# Altium schematic sheet ESP32.SchDoc
size A2; SheetNumber: 2; SheetTotal: 4
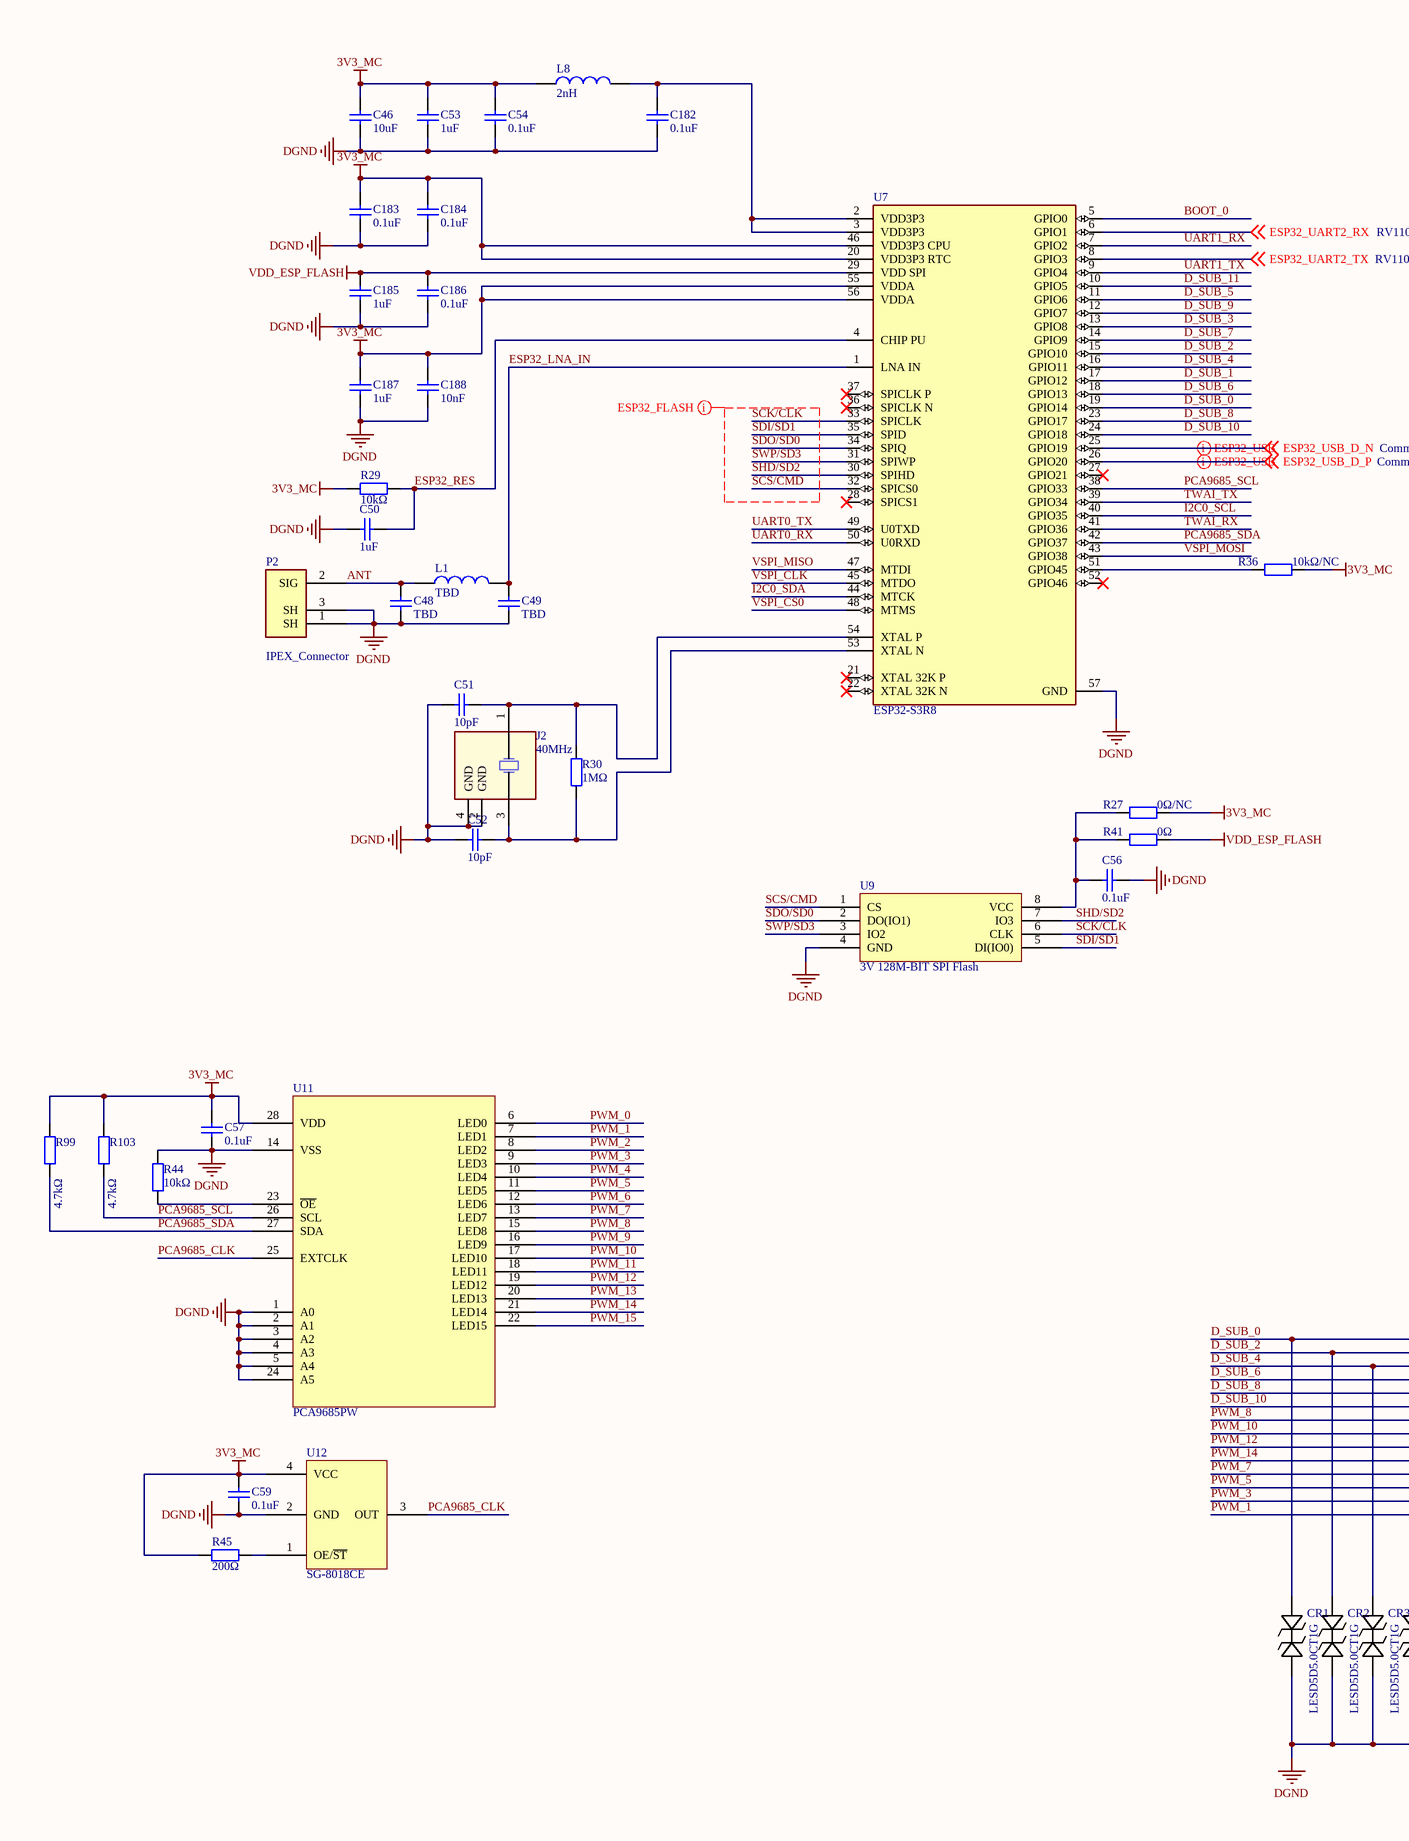
[diagram p0: ESP32.SchDoc, left]
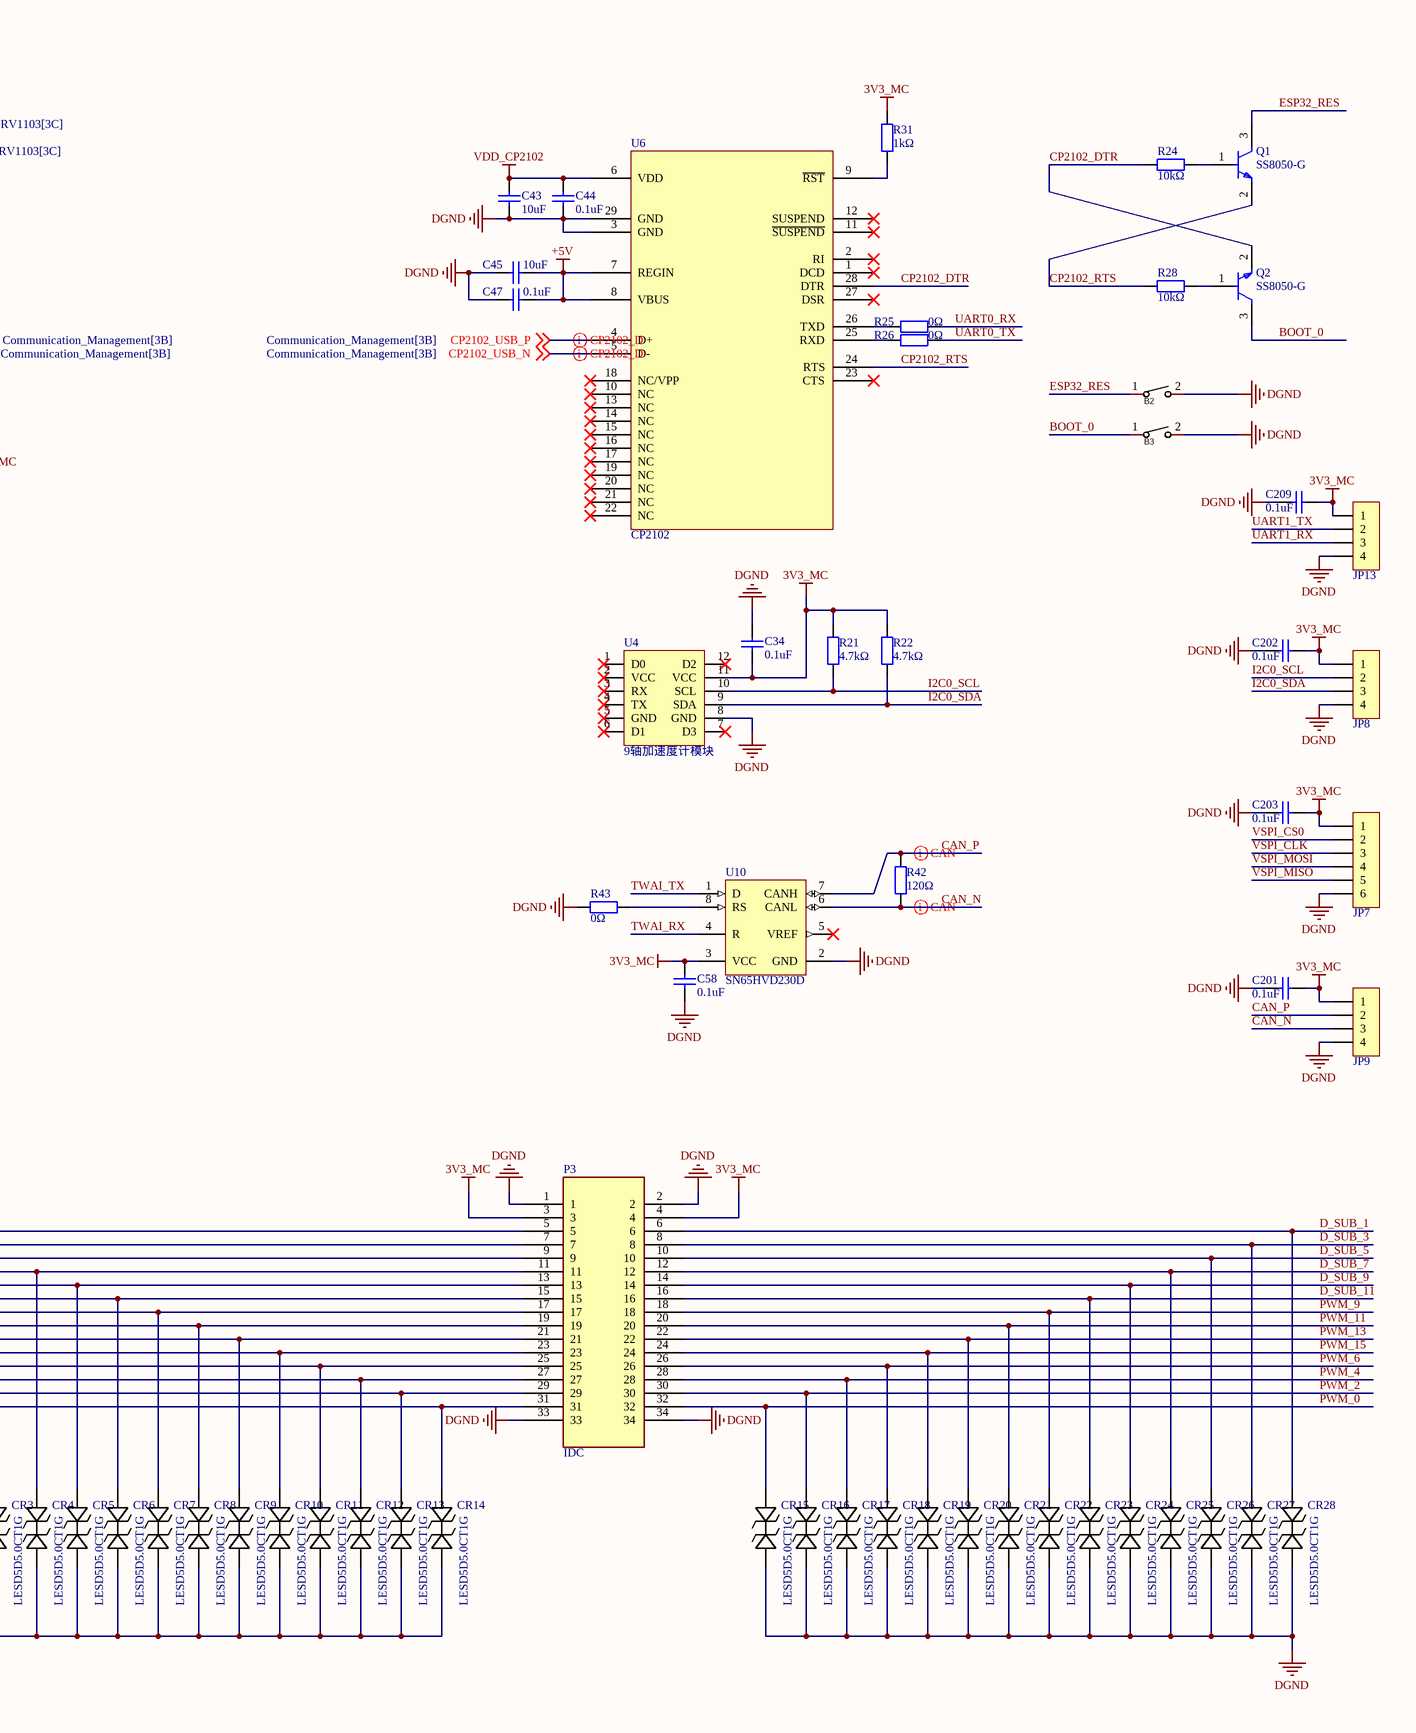
[diagram p1: ESP32.SchDoc, right]

## Parts
B2  Bottom-2P-1Way  [SW-SMD_L4.0-W2.9-LS5.0]  (value not drawn)
B3  Bottom-2P-1Way  [SW-SMD_L4.0-W2.9-LS5.0]  (value not drawn)
C34  0.1uF  [0603_C]
C43  10uF  [0603_C]
C44  0.1uF  [0603_C]
C45  10uF  [0603_C]
C46  10uF  [0603_C]
C47  0.1uF  [0603_C]
C48  TBD  [0402_C]
C49  TBD  [0402_C]
C50  1uF  [0402_C]
C51  10pF  [0402_C]
C52  10pF  [0402_C]
C53  1uF  [0603_C]
C54  0.1uF  [0402_C]
C56  0.1uF  [0603_C]
C57  0.1uF  [0603_C]
C58  0.1uF  [0603_C]
C59  0.1uF  [0603_C]
C182  0.1uF  [0402_C]
C183  0.1uF  [0402_C]
C184  0.1uF  [0402_C]
C185  1uF  [0402_C]
C186  0.1uF  [0402_C]
C187  1uF  [0402_C]
C188  10nF  [0402_C]
C201  0.1uF  [0603_C]
C202  0.1uF  [0603_C]
C203  0.1uF  [0603_C]
C209  0.1uF  [0603_C]
CR1  LESD5D5.0CT1G  [CR_5.0CT1G_UMW]
CR2  LESD5D5.0CT1G  [CR_5.0CT1G_UMW]
CR3  LESD5D5.0CT1G  [CR_5.0CT1G_UMW]
CR4  LESD5D5.0CT1G  [CR_5.0CT1G_UMW]
CR5  LESD5D5.0CT1G  [CR_5.0CT1G_UMW]
CR6  LESD5D5.0CT1G  [CR_5.0CT1G_UMW]
CR7  LESD5D5.0CT1G  [CR_5.0CT1G_UMW]
CR8  LESD5D5.0CT1G  [CR_5.0CT1G_UMW]
CR9  LESD5D5.0CT1G  [CR_5.0CT1G_UMW]
CR10  LESD5D5.0CT1G  [CR_5.0CT1G_UMW]
CR11  LESD5D5.0CT1G  [CR_5.0CT1G_UMW]
CR12  LESD5D5.0CT1G  [CR_5.0CT1G_UMW]
CR13  LESD5D5.0CT1G  [CR_5.0CT1G_UMW]
CR14  LESD5D5.0CT1G  [CR_5.0CT1G_UMW]
CR15  LESD5D5.0CT1G  [CR_5.0CT1G_UMW]
CR16  LESD5D5.0CT1G  [CR_5.0CT1G_UMW]
CR17  LESD5D5.0CT1G  [CR_5.0CT1G_UMW]
CR18  LESD5D5.0CT1G  [CR_5.0CT1G_UMW]
CR19  LESD5D5.0CT1G  [CR_5.0CT1G_UMW]
CR20  LESD5D5.0CT1G  [CR_5.0CT1G_UMW]
CR21  LESD5D5.0CT1G  [CR_5.0CT1G_UMW]
CR22  LESD5D5.0CT1G  [CR_5.0CT1G_UMW]
CR23  LESD5D5.0CT1G  [CR_5.0CT1G_UMW]
CR24  LESD5D5.0CT1G  [CR_5.0CT1G_UMW]
CR25  LESD5D5.0CT1G  [CR_5.0CT1G_UMW]
CR26  LESD5D5.0CT1G  [CR_5.0CT1G_UMW]
CR27  LESD5D5.0CT1G  [CR_5.0CT1G_UMW]
CR28  LESD5D5.0CT1G  [CR_5.0CT1G_UMW]
J2  40MHz  [SMD-2520_4P]
JP7  HDR-1X6  [MX 1.25-LS-6P]  (value not drawn)
JP8  HDR-1X4  [MX 1.25-LS-4P]  (value not drawn)
JP9  HDR-1X4  [MX 1.25-LS-4P]  (value not drawn)
JP13  HDR-1X4  [MX 1.25-LS-4P]  (value not drawn)
L1  TBD  [0402_L]
L8  2nH  [0402_L]
P2  IPEX_Connector  [IPEX]
P3  IDC  [IDC2.54-LI-2x17P]
Q1  SS8050-G  [FP-SS8050-G-MFG]
Q2  SS8050-G  [FP-SS8050-G-MFG]
R21  4.7kΩ  [0603_R]
R22  4.7kΩ  [0603_R]
R24  10kΩ  [0603_R]
R25  0Ω  [0603_R]
R26  0Ω  [0603_R]
R27  0Ω/NC  [0402_R]
R28  10kΩ  [0603_R]
R29  10kΩ  [0402_R]
R30  1MΩ  [0402_R]
R31  1kΩ  [0603_R]
R36  10kΩ/NC  [0402_R]
R41  0Ω  [0402_R]
R42  120Ω  [0805_R]
R43  0Ω  [0603_R]
R44  10kΩ  [0603_R]
R45  200Ω  [0603_R]
R99  4.7kΩ  [0603_R]
R103  4.7kΩ  [0603_R]
U4  9轴加速度计模块  [9轴加速度计]
U6  CP2102  [QFN50P500X500X100_HS-29N]
U7  ESP32-S3R8  [QFN40P700X700X90_HS-57M]
U9  3V 128M-BIT SPI Flash  [SOIC-8-Body 5.28x5.28mm]
U10  SN65HVD230D  [D0008A_M]
U11  PCA9685PW  [SOP65P640X110-28N]
U12  SG-8018CE  [OSC-2520-4P]

## Nets
3V3_MC: C34.1 C46.2 C53.2 C54.2 C57.2 C58.2 C59.2 C183.2 C184.2 C187.2 C188.2 C201.2 C202.2 C203.2 C209.2 JP7.1 JP8.1 JP9.1 JP13.1 L8.1 P3.3 P3.4 R21.2 R22.2 R27.2 R29.1 R31.2 R36.2 R45.2 R99.1 R103.1 U4.11(VCC) U7.20(VDD3P3_RTC) U7.46(VDD3P3_CPU) U7.55(VDDA) U7.56(VDDA) U10.3(VCC) U11.28(VDD) U12.4(VCC)
+5V: C45.1 C47.1 U6.7(REGIN) U6.8(VBUS)
DGND: B2.2 B3.2 C34.2 C43.2 C44.2 C45.2 C46.1 C47.2 C48.1 C49.1 C50.1 C51.1 C52.1 C53.1 C54.1 C56.2 C57.1 C58.1 C59.1 C182.1 C183.1 C184.1 C185.1 C186.1 C187.1 C188.1 C201.1 C202.1 C203.1 C209.1 CR1.2 CR2.2 CR3.2 CR4.2 CR5.2 CR6.2 CR7.2 CR8.2 CR9.2 CR10.2 CR11.2 CR12.2 CR13.2 CR14.2 CR15.2 CR16.2 CR17.2 CR18.2 CR19.2 CR20.2 CR21.2 CR22.2 CR23.2 CR24.2 CR25.2 CR26.2 CR27.2 CR28.2 J2.2(GND) J2.4(GND) JP7.6 JP8.4 JP9.4 JP13.4 P2.1(SH) P2.3(SH) P3.1 P3.2 P3.33 P3.34 R43.1 R44.2 U4.8(GND) U6.3(GND) U6.29(GND) U7.57(GND) U9.4(GND) U10.2(GND) U11.1(A0) U11.2(A1) U11.3(A2) U11.4(A3) U11.5(A4) U11.14(VSS) U11.24(A5) U12.2(GND)
VDD_CP2102: C43.1 C44.1 U6.6(VDD)
VDD_ESP_FLASH: C185.2 C186.2 R41.2 U7.29(VDD_SPI)
ANT: C48.2 L1.1 P2.2(SIG)
BOOT_0: B3.1 Q2.3(C) U7.5(GPIO0)
CAN_N: JP9.3 R42.1 U10.6(CANL)
CAN_P: JP9.2 R42.2 U10.7(CANH)
CP2102_DTR: Q2.2(E) R24.1 U6.28(DTR)
CP2102_RTS: Q1.2(E) R28.1 U6.24(RTS)
CP2102_USB_N: U6.5(D-) ; off-sheet CP2102_USB_N
CP2102_USB_P: U6.4(D+) ; off-sheet CP2102_USB_P
D_SUB_0: CR1.1 P3.5 U7.19(GPIO14)
D_SUB_1: CR28.1 P3.6 U7.17(GPIO12)
D_SUB_2: CR2.1 P3.7 U7.15(GPIO10)
D_SUB_3: CR27.1 P3.8 U7.13(GPIO8)
D_SUB_4: CR3.1 P3.9 U7.16(GPIO11)
D_SUB_5: CR26.1 P3.10 U7.11(GPIO6)
D_SUB_6: CR4.1 P3.11 U7.18(GPIO13)
D_SUB_7: CR25.1 P3.12 U7.14(GPIO9)
D_SUB_8: CR5.1 P3.13 U7.23(GPIO17)
D_SUB_9: CR24.1 P3.14 U7.12(GPIO7)
D_SUB_10: CR6.1 P3.15 U7.24(GPIO18)
D_SUB_11: CR23.1 P3.16 U7.10(GPIO5)
ESP32_LNA_IN: C49.2 L1.2 U7.1(LNA_IN)
ESP32_RES: B2.1 C50.2 Q1.3(C) R29.2 U7.4(CHIP_PU)
ESP32_UART2_RX: U7.6(GPIO1) ; off-sheet ESP32_UART2_RX
ESP32_UART2_TX: U7.8(GPIO3) ; off-sheet ESP32_UART2_TX
ESP32_USB_D_N: U7.25(GPIO19) ; off-sheet ESP32_USB_D_N
ESP32_USB_D_P: U7.26(GPIO20) ; off-sheet ESP32_USB_D_P
I2C0_SCL: JP8.2 R21.1 U4.10(SCL) U7.40(GPIO35)
I2C0_SDA: JP8.3 R22.1 U4.9(SDA) U7.44(MTCK)
PCA9685_CLK: U11.25(EXTCLK) U12.3(OUT)
PCA9685_SCL: R103.2 U7.38(GPIO33) U11.26(SCL)
PCA9685_SDA: R99.2 U7.42(GPIO37) U11.27(SDA)
PWM_0: CR15.1 P3.32 U11.6(LED0)
PWM_1: CR14.1 P3.31 U11.7(LED1)
PWM_2: CR16.1 P3.30 U11.8(LED2)
PWM_3: CR13.1 P3.29 U11.9(LED3)
PWM_4: CR17.1 P3.28 U11.10(LED4)
PWM_5: CR12.1 P3.27 U11.11(LED5)
PWM_6: CR18.1 P3.26 U11.12(LED6)
PWM_7: CR11.1 P3.25 U11.13(LED7)
PWM_8: CR7.1 P3.17 U11.15(LED8)
PWM_9: CR22.1 P3.18 U11.16(LED9)
PWM_10: CR8.1 P3.19 U11.17(LED10)
PWM_11: CR21.1 P3.20 U11.18(LED11)
PWM_12: CR9.1 P3.21 U11.19(LED12)
PWM_13: CR20.1 P3.22 U11.20(LED13)
PWM_14: CR10.1 P3.23 U11.21(LED14)
PWM_15: CR19.1 P3.24 U11.22(LED15)
SCK/CLK: U7.33(SPICLK) U9.6(CLK)
SCS/CMD: U7.32(SPICS0) U9.1(CS)
SDI/SD1: U7.35(SPID) U9.5(DI(IO0))
SDO/SD0: U7.34(SPIQ) U9.2(DO(IO1))
SHD/SD2: U7.30(SPIHD) U9.7(IO3)
SWP/SD3: U7.31(SPIWP) U9.3(IO2)
TWAI_RX: U7.41(GPIO36) U10.4(R)
TWAI_TX: U7.39(GPIO34) U10.1(D)
UART0_RX: R25.2 U7.50(U0RXD)
UART0_TX: R26.2 U7.49(U0TXD)
UART1_RX: JP13.3 U7.7(GPIO2)
UART1_TX: JP13.2 U7.9(GPIO4)
VSPI_CLK: JP7.3 U7.45(MTDO)
VSPI_CS0: JP7.2 U7.48(MTMS)
VSPI_MISO: JP7.5 U7.47(MTDI)
VSPI_MOSI: JP7.4 U7.43(GPIO38)
NetC51_2: C51.2 J2.1(OSC1) R30.1 U7.54(XTAL_P)
NetC52_2: C52.2 J2.3(OSC2) R30.2 U7.53(XTAL_N)
NetC56_1: C56.1 R27.1 R41.1 U9.8(VCC)
NetC182_2: C182.2 L8.2 U7.2(VDD3P3) U7.3(VDD3P3)
NetQ1_1: Q1.1(B) R24.2
NetQ2_1: Q2.1(B) R28.2
NetR25_1: R25.1 U6.26(TXD)
NetR26_1: R26.1 U6.25(RXD)
NetR31_1: R31.1 U6.9(~{RST})
NetR36_1: R36.1 U7.51(GPIO45)
NetR43_2: R43.2 U10.8(RS)
NetR44_1: R44.1 U11.23(~{OE})
NetR45_1: R45.1 U12.1(OE/~{ST})

Not connected (* = marked no-connect by the designer): U4 1(D0)* 2(VCC)* 3(RX)* 4(TX)* 5(GND)* 6(D1)* 7(D3)* 12(D2)*; U6 1(DCD)* 2(RI)* 10(NC)* 11(~{SUSPEND})* 12(SUSPEND)* 13(NC)* 14(NC)* 15(NC)* 16(NC)* 17(NC)* 18(NC/VPP)* 19(NC)* 20(NC)* 21(NC)* 22(NC)* 23(CTS)* 27(DSR)*; U7 21(XTAL_32K_P)* 22(XTAL_32K_N)* 27(GPIO21)* 28(SPICS1)* 36(SPICLK_N)* 37(SPICLK_P)* 52(GPIO46)*; U10 5(VREF)*

## Layout directives
differential pair: CAN_N, CAN_P, CP2102_USB_N, CP2102_USB_P, ESP32_USB_D_N, ESP32_USB_D_P
net class ESP32_FLASH: SCK/CLK, SCS/CMD, SDI/SD1, SDO/SD0, SHD/SD2, SWP/SD3

## Library data of the parts
B2 B3 = Bottom-2P-1Way: 轻触按键; Manufacturer: SHOU HAN(首韩); Symbol: TS342A2P-WZ; Add into BOM: yes; Device: TS342A2P-WZ; LCSC Part Name: 轻触开关 3*4*2 两脚小龟不带柱 250gf 黑色塑胶按钮; Supplier Part: C557591; Manufacturer Part: TS342A2P-WZ; Supplier Footprint: SMD; JLCPCB Part Class: Extended Part; Datasheet: https://atta.szlcsc.com/upload/public/pdf/source/20200519/C557591_B3A5A21584733303F06306F18577DA8B.pdf; Supplier: LCSC; Convert to PCB: yes
C34 C43-C54 C56-C59 C182-C188 C201-C203 C209 = SMT_Cap: 贴片电容; ComponentLink1Description: 供应商链接; ComponentLink1URL: http://www.szlcsc.com/product/details_29010.html; Package: 0805; Supplier: LC; SuppliersPartNumber: C28260
CR1-CR28 = LESD5D5.0CT1G: TVS; Mfr_Name: UMW(Youtai Semiconductor Co., Ltd.); Type: Current Regulation - Diodes, Transistors
J2 = Oscillator_SMT_4P
JP7 = Header 6: 6P接插件; 卖家免费技术支持，联系售后: 唯一出售店铺网址https://shop463601444.taobao.com; 封装库来自淘宝卖家 ID：黄晶宝石: 其他店铺购入均为假冒，请申请退款，本店现金奖励; 优秀评价可免费更新封装库: 联系淘宝ID：黄晶宝石，获取更新版封装库; BOM名称: 6P接插件
JP8 JP9 JP13 = Header 4: 4P接插件; 卖家免费技术支持，联系售后: 唯一出售店铺网址https://shop463601444.taobao.com; 封装库来自淘宝卖家 ID：黄晶宝石: 其他店铺购入均为假冒，请申请退款，本店现金奖励; 优秀评价可免费更新封装库: 联系淘宝ID：黄晶宝石，获取更新版封装库; BOM名称: 4P接插件
L1 L8 = SMT_Iud: 贴片电感; ComponentLink1Description: 供应商链接; ComponentLink1URL: http://www.szlcsc.com/product/details_30010.html; Package: 0603; Supplier: LC; SuppliersPartNumber: C29258
P3 = IDC 2x17P
Q1 Q2 = CMP-20235-000001-1: NPN TRANSISTOR 1.5A 40V SOT-23 R; Transition Frequency: 100MHz; Max Breakdown Voltage: 25V; Collector Emitter Voltage (VCEO): 400mV; Max Power Dissipation: 300mW; Max Collector Current: 1.5A; Case/Package: TO-236-3; Packaging: Tape and Reel; RoHS Compliant: Yes; Mount: Surface Mount; Collector Emitter Breakdown Voltage: 25V
R21 R22 R24-R31 R36 R41-R45 R99 R103 = SMT_Res: 贴片电阻; ComponentLink1Description: 供应商链接; ComponentLink1URL: http://www.szlcsc.com/product/details_23980.html; Package: 0603; Supplier: LC; SuppliersPartNumber: C23253
U4 = 9轴加速度计
U6 = CP2102: SINGLE-CHIP USB TO UART BRIDGE
U7 = ESP32-S3R8: ESP32-S3R8 RF System; NexarPartId: 118292493
U9 = W25Q128JVPIQ: The W25Q128JV (128M-bit) Serial Flash memory provides a storage solution for systems with limited / space, pins and power.
U10 = CMP-0315-00046-3: CAN Bus Transceiver, 3.3 V, -40 to 85 degC, 8-Pin SOIC (D), Green (RoHS & no Sb/Br), Tube; Supply Voltage Min: 3 V; Supply Voltage Max: 3.6 V; PartNumber: SN65HVD230D; ComponentLink2URL: http://www.ti.com/general/docs/lit/getliterature.tsp?genericGeneric Part Number=SN65HVD230&fileType=pdf; DatasheetVersion: SLOS346N; Generic Part Number: SN65HVD230; Packing: Tube; Temperature Min: -40 degC; Temperature Max: 85 degC; ComponentLink1Description: Manufacturer URL; Mounting Technology: Surface Mount; RoHS: TRUE; ComponentLink1URL: http://www.ti.com/; ComponentLink2Description: Datasheet; PackageDescription: 8-Pin Plastic Small Outline, Body 4.9 x 3.9 mm, Pitch 1.27 mm
U11 = PCA9685PW: 16-Channel, 12-bit PWM Fm+ I²C-Bus LED Driver
U12 = SG-8018CG_50Mhz: CRYSTAL OSCILLATOR (Programmable)